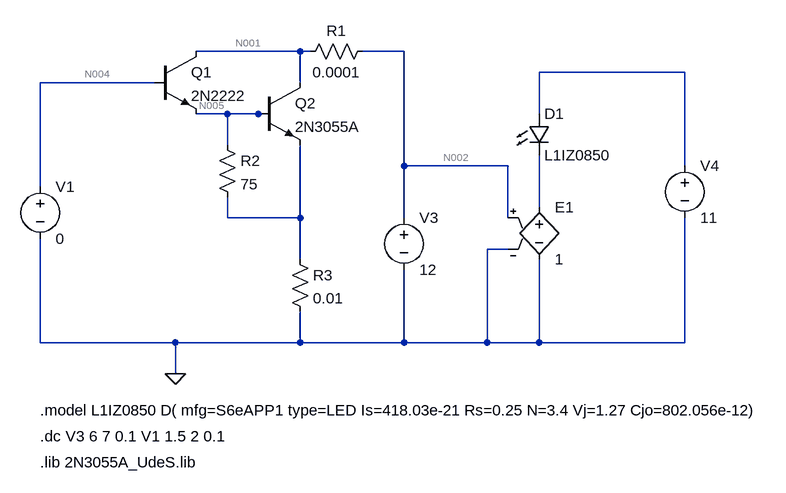
[diagram p0: schematic Analyse_Courant.asc]
Analyse_Courant.asc, the LTspice schematic file:
Version 4
SHEET 1 1904 824
WIRE 1168 176 1008 176
WIRE 1184 176 1168 176
WIRE 1328 176 1264 176
WIRE 1760 208 1536 208
WIRE 944 224 768 224
WIRE 1168 224 1168 176
WIRE 1056 272 1008 272
WIRE 1104 272 1056 272
WIRE 1120 272 1104 272
WIRE 1536 272 1536 208
WIRE 1056 320 1056 272
WIRE 1328 352 1328 176
WIRE 1488 352 1328 352
WIRE 1760 352 1760 208
WIRE 768 384 768 224
WIRE 1536 416 1536 336
WIRE 1056 432 1056 400
WIRE 1168 432 1168 320
WIRE 1168 432 1056 432
WIRE 1328 432 1328 352
WIRE 1488 432 1488 352
WIRE 1488 480 1456 480
WIRE 1168 496 1168 432
WIRE 768 624 768 464
WIRE 976 624 768 624
WIRE 1168 624 1168 576
WIRE 1168 624 976 624
WIRE 1328 624 1328 512
WIRE 1328 624 1168 624
WIRE 1456 624 1456 480
WIRE 1456 624 1328 624
WIRE 1536 624 1536 496
WIRE 1536 624 1456 624
WIRE 1760 624 1760 432
WIRE 1760 624 1536 624
WIRE 976 672 976 624
FLAG 976 672 0
SYMBOL npn 944 176 R0
SYMATTR InstName Q1
SYMATTR Value 2N2222
SYMBOL npn 1104 224 R0
SYMATTR InstName Q2
SYMATTR Value 2N3055A
SYMBOL voltage 1328 416 R0
WINDOW 123 0 0 Left 0
WINDOW 39 0 0 Left 0
SYMATTR InstName V3
SYMATTR Value 12
SYMBOL voltage 1760 336 R0
WINDOW 123 0 0 Left 0
WINDOW 39 0 0 Left 0
SYMATTR InstName V4
SYMATTR Value 11
SYMBOL e 1536 400 R0
SYMATTR InstName E1
SYMATTR Value 1
SYMBOL LED 1520 272 R0
SYMATTR InstName D1
SYMATTR Value L1IZ0850
SYMBOL res 1280 160 R90
WINDOW 0 0 56 VBottom 2
WINDOW 3 32 56 VTop 2
SYMATTR InstName R1
SYMATTR Value 0.0001
SYMBOL Res 1040 304 R0
SYMATTR InstName R2
SYMATTR Value 75
SYMBOL Res 1152 480 R0
SYMATTR InstName R3
SYMATTR Value 0.01
SYMBOL voltage 768 368 R0
SYMATTR InstName V1
SYMATTR Value 0
TEXT 768 728 Left 2 !.model L1IZ0850 D( mfg=S6eAPP1 type=LED Is=418.03e-21 Rs=0.25 N=3.4 Vj=1.27 Cjo=802.056e-12)
TEXT 768 768 Left 2 !.dc V3 6 7 0.1 V1 1.5 2 0.1
TEXT 768 808 Left 2 !.lib 2N3055A_UdeS.lib

The netlist it stands for:
* Analyse_Courant.asc
Q1 N001 N004 N005 0 2N2222
Q2 N001 N005 N007 0 2N3055A
V3 N002 0 12
V4 N003 0 11
E1 N006 0 N002 0 1
D1 N003 N006 L1IZ0850
R1 N002 N001 0.0001
R2 N005 N007 75
R3 N007 0 0.01
V1 N004 0 0
.model D D
.lib standard.dio
.model NPN NPN
.model PNP PNP
.lib standard.bjt
.model L1IZ0850 D( mfg=S6eAPP1 type=LED Is=418.03e-21 Rs=0.25 N=3.4 Vj=1.27 Cjo=802.056e-12)
.dc V3 6 7 0.1 V1 1.5 2 0.1
.lib 2N3055A_UdeS.lib
.backanno
.end

* Results of the author's LTspice run, read from the files saved beside the schematic
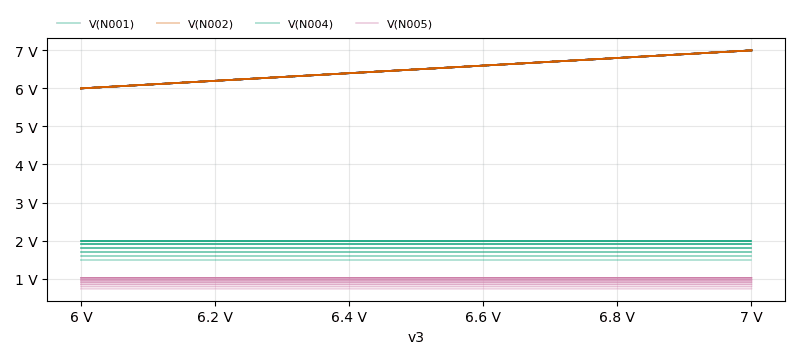
[diagram p1: DC transfer characteristic of Analyse_Courant.asc, plotted from the saved traces]
* DC transfer characteristic, 6 runs:
*   V(N001) [v1=1.5]: 6 V at v3=6 V, 7 V at v3=7 V, min 6 V, max 7 V
*   V(N001) [v1=1.6]: 6 V at v3=6 V, 7 V at v3=7 V, min 6 V, max 7 V
*   V(N001) [v1=1.7]: 6 V at v3=6 V, 7 V at v3=7 V, min 6 V, max 7 V
*   V(N001) [v1=1.8]: 6 V at v3=6 V, 7 V at v3=7 V, min 6 V, max 7 V
*   V(N001) [v1=1.9]: 6 V at v3=6 V, 7 V at v3=7 V, min 6 V, max 7 V
*   V(N001) [v1=2]: 6 V at v3=6 V, 7 V at v3=7 V, min 6 V, max 7 V
*   V(N002) [v1=1.5]: 6 V at v3=6 V, 7 V at v3=7 V, min 6 V, max 7 V
*   V(N002) [v1=1.6]: 6 V at v3=6 V, 7 V at v3=7 V, min 6 V, max 7 V
*   V(N002) [v1=1.7]: 6 V at v3=6 V, 7 V at v3=7 V, min 6 V, max 7 V
*   V(N002) [v1=1.8]: 6 V at v3=6 V, 7 V at v3=7 V, min 6 V, max 7 V
*   V(N002) [v1=1.9]: 6 V at v3=6 V, 7 V at v3=7 V, min 6 V, max 7 V
*   V(N002) [v1=2]: 6 V at v3=6 V, 7 V at v3=7 V, min 6 V, max 7 V
*   V(N004) [v1=1.5]: 1.5 V at v3=6 V, 1.5 V at v3=7 V, min 1.5 V, max 1.5 V
*   V(N004) [v1=1.6]: 1.6 V at v3=6 V, 1.6 V at v3=7 V, min 1.6 V, max 1.6 V
*   V(N004) [v1=1.7]: 1.7 V at v3=6 V, 1.7 V at v3=7 V, min 1.7 V, max 1.7 V
*   V(N004) [v1=1.8]: 1.8 V at v3=6 V, 1.8 V at v3=7 V, min 1.8 V, max 1.8 V
*   V(N004) [v1=1.9]: 1.9 V at v3=6 V, 1.9 V at v3=7 V, min 1.9 V, max 1.9 V
*   V(N004) [v1=2]: 2 V at v3=6 V, 2 V at v3=7 V, min 2 V, max 2 V
*   V(N005) [v1=1.5]: 731.6 mV at v3=6 V, 731.8 mV at v3=7 V, min 731.6 mV, max 731.8 mV
*   V(N005) [v1=1.6]: 791.6 mV at v3=6 V, 791.9 mV at v3=7 V, min 791.6 mV, max 791.9 mV
*   V(N005) [v1=1.7]: 850.4 mV at v3=6 V, 850.8 mV at v3=7 V, min 850.4 mV, max 850.8 mV
*   V(N005) [v1=1.8]: 907.9 mV at v3=6 V, 908.5 mV at v3=7 V, min 907.9 mV, max 908.5 mV
*   V(N005) [v1=1.9]: 963.9 mV at v3=6 V, 964.6 mV at v3=7 V, min 963.9 mV, max 964.6 mV
*   V(N005) [v1=2]: 1.018 V at v3=6 V, 1.019 V at v3=7 V, min 1.018 V, max 1.019 V